# Altium schematic sheet obc-v2_INDEX.SchDoc
size 420 x 297 mm; SheetNumber: 2; SheetTotal: 23
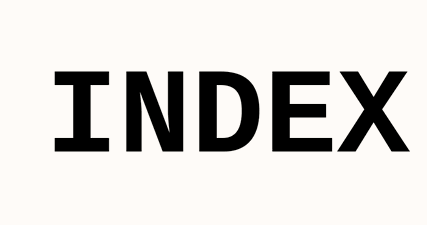
[diagram p0: obc-v2_INDEX.SchDoc]

## Notes on the sheet
- INDEX
- Project:
- Sub-system:
- Design by:
- Sheet title:
- Sheet
- A3
- of
- Checked by:
- Approved by:
- Revision:
- Document No:
- Size:
- Date: